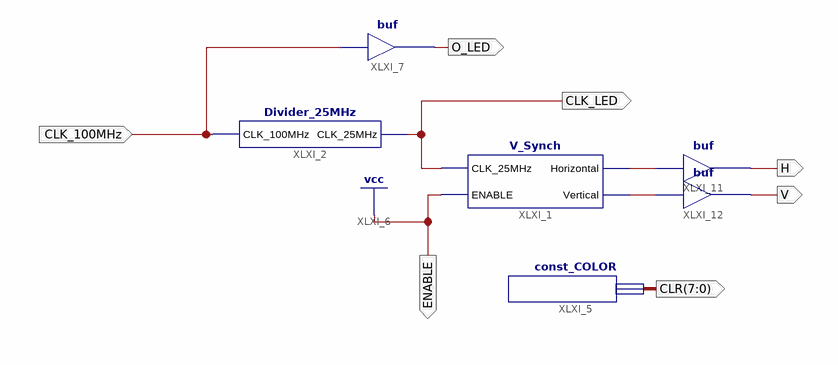
[diagram p0: schematic sheet 1]
// Xilinx ISE schematic VGA_Oscillator.sch (spartan6) as structural Verilog: 6 symbols, 7 ports
module VGA_Oscillator (
  input  CLK_100MHz,
  output ENABLE,
  output [7:0] CLR,
  output CLK_LED,
  output O_LED,
  output H,
  output V
);

  wire XLXN_20, XLXN_21;

  V_Synch XLXI_1 (.CLK_25MHz(CLK_LED), .ENABLE(1'b1), .Horizontal(XLXN_20), .Vertical(XLXN_21));
  Divider_25MHz XLXI_2 (.CLK_100MHz(CLK_100MHz), .CLK_25MHz(CLK_LED));
  const_COLOR XLXI_5 (.COLOR(CLR));
  buf XLXI_7 (O_LED, CLK_100MHz);
  buf XLXI_11 (H, XLXN_20);
  buf XLXI_12 (V, XLXN_21);

  assign ENABLE = 1'b1;
endmodule
